# EAGLE design clock (EAGLE 9.6.2)
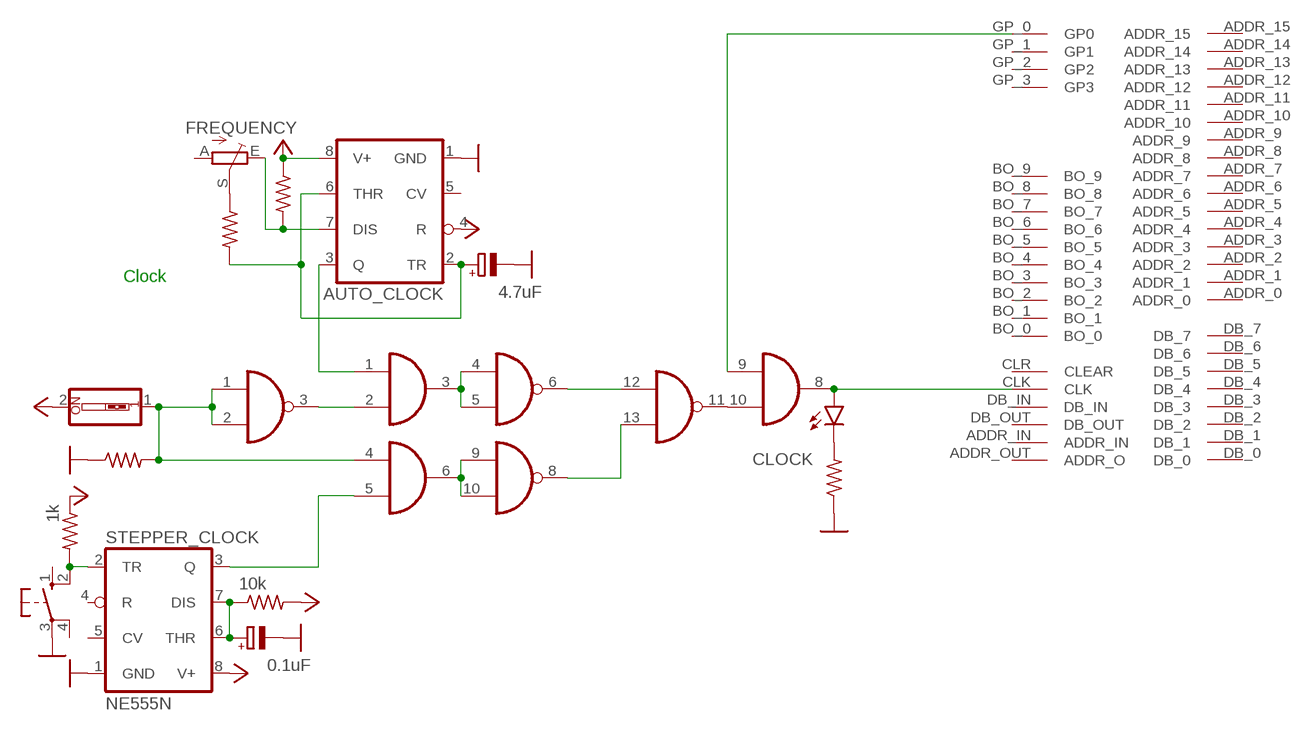
[diagram p0: schematic, sheet 1]

## Parts
AND_GATE_  74LS08N  [DIL14]
AUTO_CLOCK  NE555N  [DIL08]
C1  4.7uF  CPOL-EUE2-5  [E2-5]
C2  0.1uF  CPOL-EUE2-5  [E2-5]
CLK_MODE  SWITCH  SW_DIP-1  [EDG-01]
CLK_TRIGGER  SWITCH  10-XX  [B3F-10XX]
CLOCK  Yellow  LED5MM  [LED5MM]
FREQUENCY  100k  TRIM_EU-RJ9W  [RJ9W]
NAND  74ACT00N  [DIL14]
R1  1k  R-US_0204/7  [0204/7]
R2  1k  R-US_0204/7  [0204/7]
R3  10k  R-US_0204/7  [0204/7]
R4  220  R-US_0204/7  [0204/7]
R5  ~220  R-US_0204/7  [0204/7]
R6  220  R-US_0204/7  [0204/7]
STEPPER_CLOCK  NE555N  [DIL08]
U$1  BACKPLATE_INTERFACEEDGE_FINGER  [BACK_INTERFACE-FOOT]

## Nets
CLOCK: AND_GATE_.8(C:O) CLOCK.A U$1.CLK
GND: AUTO_CLOCK.1(GND) C1.- C2.- CLK_TRIGGER.3(P) R4.1 R5.1 STEPPER_CLOCK.1(GND)
HLT: AND_GATE_.9(C:I0) U$1.GP_0(GP0)
MODE_SIGNAL: AND_GATE_.4(B:I0) CLK_MODE.1 NAND.1(A:I0) NAND.2(A:I1) R4.2
N$1: C2.+ R3.1 STEPPER_CLOCK.6(THR) STEPPER_CLOCK.7(DIS)
N$2: CLK_TRIGGER.2(S1) R2.2 STEPPER_CLOCK.2(TR)
N$3: CLOCK.K(C) R5.2
N$4: AND_GATE_.5(B:I1) STEPPER_CLOCK.3(Q)
N$5: AND_GATE_.3(A:O) NAND.4(B:I0) NAND.5(B:I1)
N$6: AND_GATE_.1(A:I0) AUTO_CLOCK.3(Q)
N$7: AND_GATE_.6(B:O) NAND.9(C:I0) NAND.10(C:I1)
N$8: NAND.8(C:O) NAND.13(D:I1)
N$9: AND_GATE_.2(A:I1) NAND.3(A:O)
N$10: NAND.6(B:O) NAND.12(D:I0)
N$11: AND_GATE_.10(C:I1) NAND.11(D:O)
N$16: AUTO_CLOCK.2(TR) AUTO_CLOCK.6(THR) C1.+ R6.2
N$51: FREQUENCY.S R6.1
N$78: AUTO_CLOCK.7(DIS) FREQUENCY.E R1.2
VCC: AUTO_CLOCK.4(R) AUTO_CLOCK.8(V+) CLK_MODE.2 R1.1 R2.1 R3.2 STEPPER_CLOCK.8(V+)
Unconnected: AND_GATE_.11(D:O) AND_GATE_.12(D:I0) AND_GATE_.13(D:I1) AUTO_CLOCK.5(CV) CLK_TRIGGER.1(S) CLK_TRIGGER.4(P1) FREQUENCY.A STEPPER_CLOCK.4(R) STEPPER_CLOCK.5(CV) U$1.ADDR_0 U$1.ADDR_1 U$1.ADDR_2 U$1.ADDR_3 U$1.ADDR_4 U$1.ADDR_5 U$1.ADDR_6 U$1.ADDR_7 U$1.ADDR_8 U$1.ADDR_9 U$1.ADDR_10 U$1.ADDR_11 U$1.ADDR_12 U$1.ADDR_13 U$1.ADDR_14 U$1.ADDR_15 U$1.ADDR_IN U$1.ADDR_OUT(ADDR_O) U$1.BO_0 U$1.BO_1 U$1.BO_2 U$1.BO_3 U$1.BO_4 U$1.BO_5 U$1.BO_6 U$1.BO_7 U$1.BO_8 U$1.BO_9 U$1.CLR(CLEAR) U$1.DB_0 U$1.DB_1 U$1.DB_2 U$1.DB_3 U$1.DB_4 U$1.DB_5 U$1.DB_6 U$1.DB_7 U$1.DB_8-(NC) U$1.DB_9-(NC) U$1.DB_10-(NC) U$1.DB_11-(NC) U$1.DB_12-(NC) U$1.DB_13-(NC) U$1.DB_14-(NC) U$1.DB_15-(NC) U$1.DB_IN U$1.DB_OUT U$1.GP_1(GP1) U$1.GP_2(GP2) U$1.GP_3(GP3) U$1.NC_0 U$1.NC_1 U$1.NC_2 U$1.NC_3 U$1.NC_4 U$1.NC_5 U$1.NC_6 U$1.NC_7

## Notes on the sheet
- Clock

## Power pins joined to a net without a drawn wire
GND: AND_GATE_.7(P:GND) NAND.7(P:GND) U$1.GND_0(GND) U$1.GND_1(GND)
VCC: AND_GATE_.14(P:VCC) NAND.14(P:VCC) U$1.VCC_0(VCC) U$1.VCC_1(VCC)

## Library data of the parts
AND_GATE_ = 74xx-eu:74*08: Quad 2-input AND gate
AUTO_CLOCK STEPPER_CLOCK = linear:*555: TIMER
C1 C2 = rcl:CPOL-EU: POLARIZED CAPACITOR, European symbol; SPICEPREFIX: C
CLK_MODE = special:SW_DIP-1: DIP SWITCH
CLK_TRIGGER = switch-omron:10-XX: OMRON SWITCH; MPN: B3F-1000; OC_FARNELL: 176432; OC_NEWARK: 36M3542
CLOCK = led:LED: LED OSRAM: - CHIPLED LG R971, LG N971, LY N971, LG Q971, LY Q971, LO R971, LY R971 LH N974, LH R974 LS Q976, LO Q976, LY Q976 LO Q996 - Hyper CHIPLED LW Q18S LB Q993, LB Q99A, LB R99A - SideLED LS A670, LO A670, LY A670, LG A670, LP A670 LB A673, LV A673, LT A673, LW A673 LH A674 LY A675 LS A676, LA A676, LO A676, LY A676, LW A676 LS A679, LY A679, LG A679 - Hyper Micro SIDELED® LS Y876, LA Y876, LO Y876, LY Y876 LT Y87S - SmartLED LW L88C, LW L88S LB L89C, LB L89S, LG L890 LS L89K, LO L89K, LY L89K LS L896, LA L896, LO L896, LY L896 - TOPLED LS T670, LO T670, LY T670, LG T670, LP T670 LSG T670, LSP T670, LSY T670, LOP T670, LYG T670 LG T671, LOG T671, LSG T671 LB T673, LV T673, LT T673, LW T673 LH T674 LS T676, LA T676, LO T676, LY T676, LB T676, LH T676, LSB T676, LW T676 LB T67C, LV T67C, LT T67C, LS T67K, LO T67K, LY T67K, LW E67C LS E67B, LA E67B, LO E67B, LY E67B, LB E67C, LV E67C, LT E67C LW T67C LS T679, LY T679, LG T679 LS T770, LO T770, LY T770, LG T770, LP T770 LB T773, LV T773, LT T773, LW T773 LH T774 LS E675, LA E675, LY E675, LS T675 LS T776, LA T776, LO T776, LY T776, LB T776 LHGB T686 LT T68C, LB T68C - Hyper Mini TOPLED® LB M676 - Mini TOPLED Santana® LG M470 LS M47K, LO M47K, LY M47K Source: http://www.osram.convergy.de LUXEON: - LUMILED® LXK2-PW12-R00, LXK2-PW12-S00, LXK2-PW14-U00, LXK2-PW14-V00 LXK2-PM12-R00, LXK2-PM12-S00, LXK2-PM14-U00 LXK2-PE12-Q00, LXK2-PE12-R00, LXK2-PE12-S00, LXK2-PE14-T00, LXK2-PE14-U00 LXK2-PB12-K00, LXK2-PB12-L00, LXK2-PB12-M00, LXK2-PB14-N00, LXK2-PB14-P00, LXK2-PB14-Q00 LXK2-PR12-L00, LXK2-PR12-M00, LXK2-PR14-Q00, LXK2-PR14-R00 LXK2-PD12-Q00, LXK2-PD12-R00, LXK2-PD12-S00 LXK2-PH12-R00, LXK2-PH12-S00 LXK2-PL12-P00, LXK2-PL12-Q00, LXK2-PL12-R00 Source: www.luxeon.com KINGBRIGHT: KA-3528ASYC Source: www.kingbright.com
FREQUENCY = pot:TRIM_EU-: POTENTIOMETER
NAND = 74xx-eu:74*00: Quad 2-input NAND gate
R1-R6 = rcl:R-US_: RESISTOR, American symbol; SPICEPREFIX: R
U$1 = Computer:BACKPLATE_INTERFACE

## Board
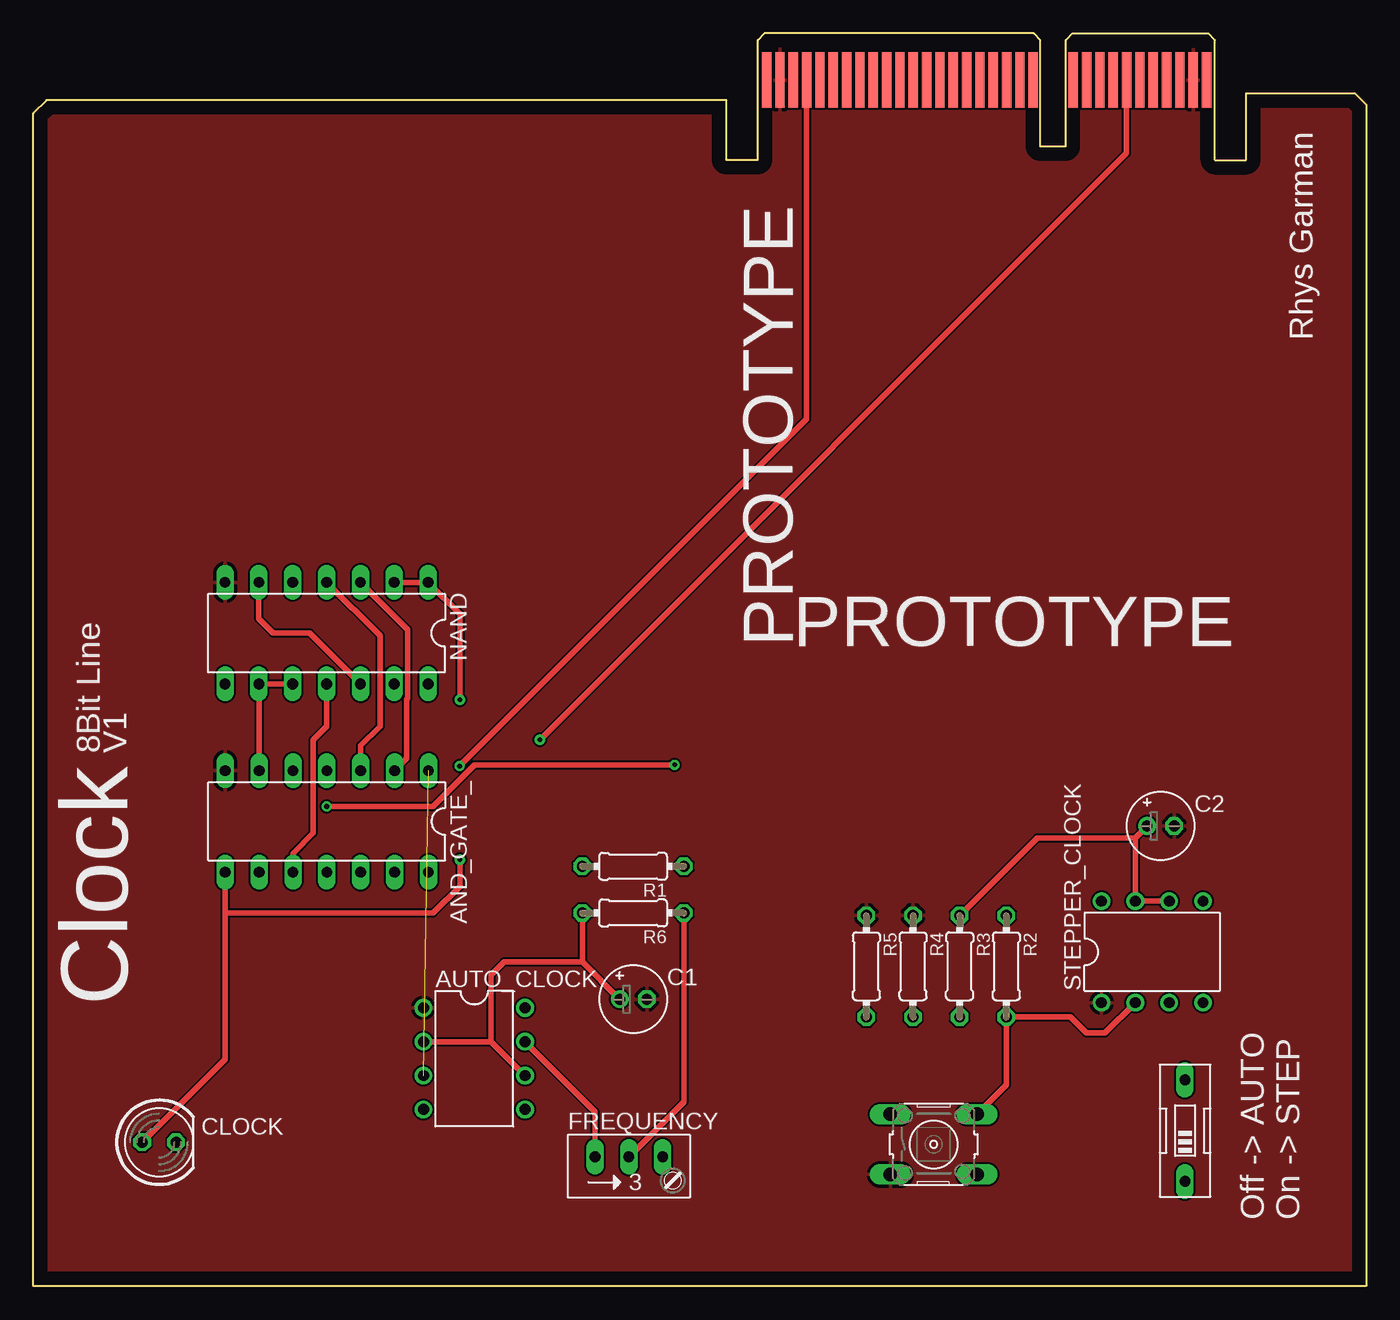
[diagram p1: board, top side]
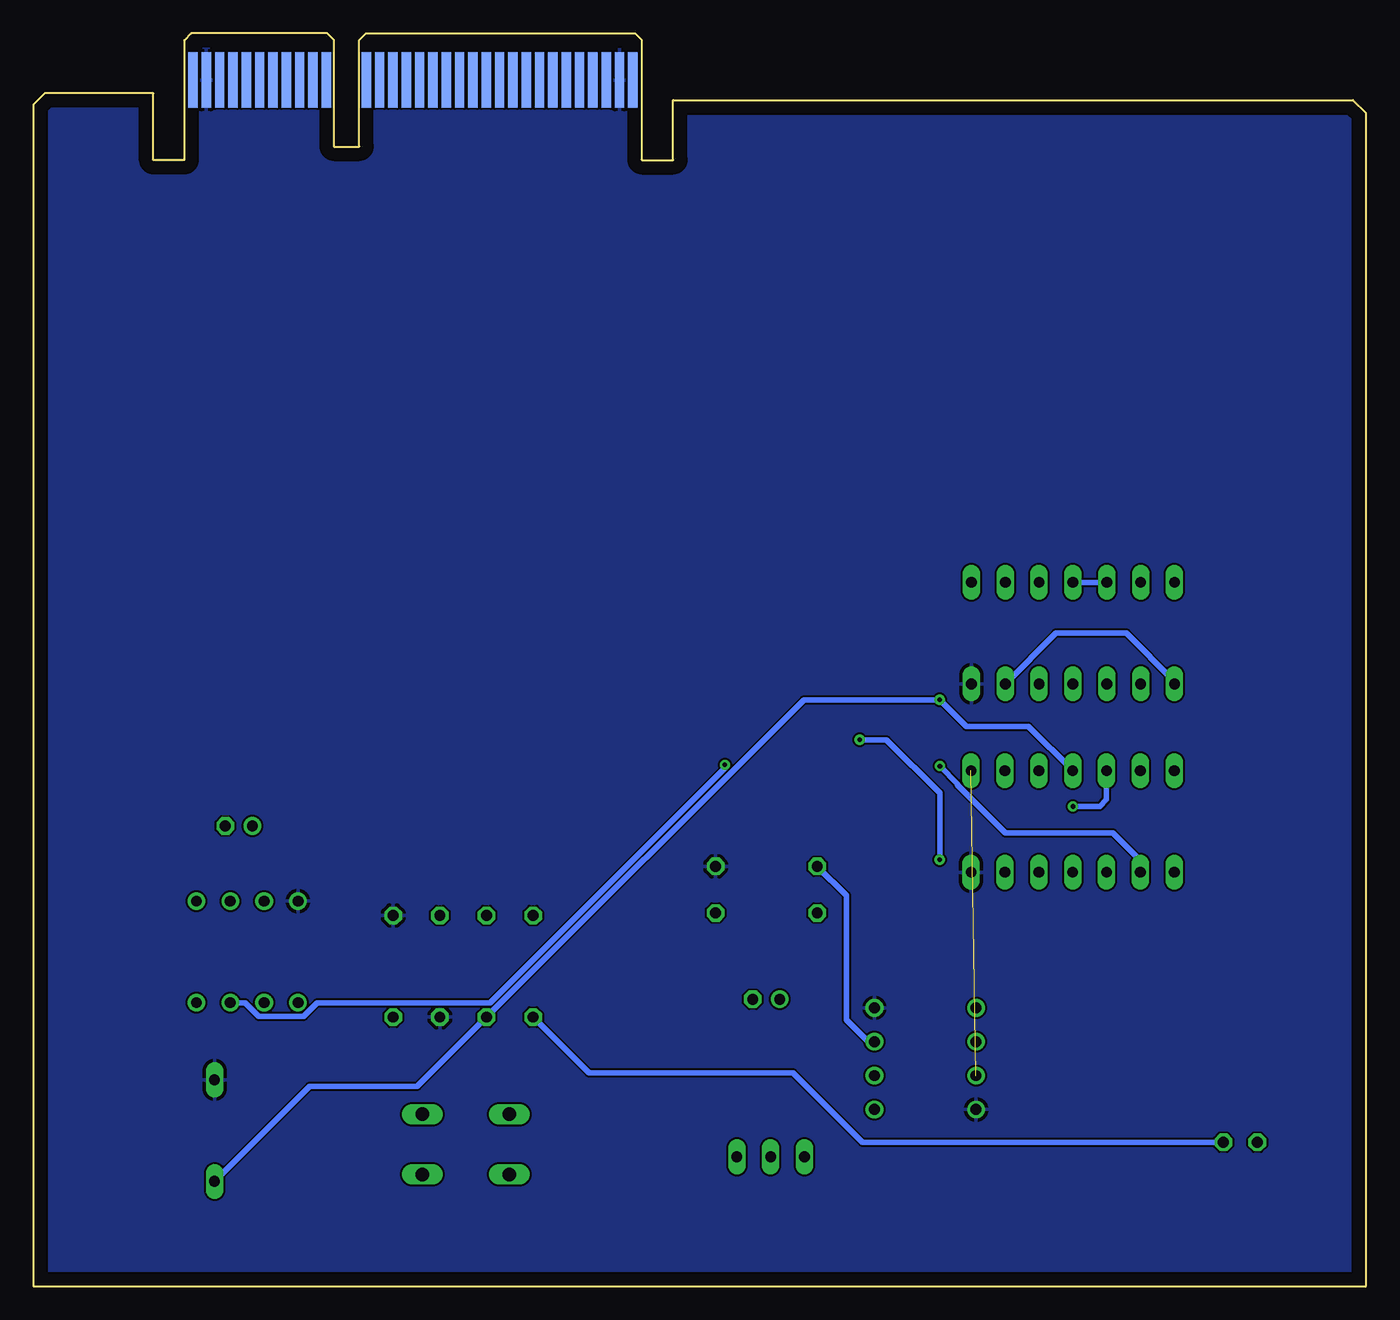
[diagram p2: board, bottom side, seen from below]

Size 100 x 94 mm. Coordinates in mm from the lower left corner, seen from the top.
Outline: 0,0 0,88 1,89 52,89 52,84.5 54.35,84.5 54.35,93.5 54.85,94 75.05,94 75.55,93.5 75.55,85.5 77.45,85.5 77.45,93.5 77.95,94 88.15,94 88.65,93.5 88.65,84.5 91,84.5 91,89.5 99.15,89.5 100,88.65 100,0 0,0
Copper layers (1*16): Top 0.035mm / dielectric 1.5mm / Bottom 0.035mm
Design rules "default": minimum track width 6mil, minimum drill 0.35mm, track to track 6mil, track to pad 6mil, pad to pad 6mil, via to via 6mil, smd to smd 6mil, copper to edge 40mil, drill to drill 6mil, minimum pad ring 10mil, minimum via ring 8mil, stop-mask expansion 4mil, vias tented up to drill 0mil, thermal gap 10mil

### Footprints (pad centres in the part's own frame; a part is rotated, then mirrored left to right if it is on the bottom)
DIL14 = drill 0.813 long: 1 -7.62,-3.81; 2 -5.08,-3.81; 3 -2.54,-3.81; 4 0,-3.81; 5 2.54,-3.81; 6 5.08,-3.81; 7 7.62,-3.81; 8 7.62,3.81; 9 5.08,3.81; 10 2.54,3.81; 11 0,3.81; 12 -2.54,3.81; 13 -5.08,3.81; 14 -7.62,3.81
DIL08 = drill 0.813 pad 1.27: 1 -3.81,-3.81; 2 -1.27,-3.81; 3 1.27,-3.81; 4 3.81,-3.81; 5 3.81,3.81; 6 1.27,3.81; 7 -1.27,3.81; 8 -3.81,3.81
E2-5 = drill 0.813 pad 1.27: + -1.016,0 | drill 0.813 pad 1.27 octagon: - 1.016,0
EDG-01 = drill 0.813 long: 1 0,-3.81; 2 0,3.81
B3F-10XX = drill 1.016 long: 1 -3.251,2.261; 2 3.251,2.261; 3 -3.251,-2.261; 4 3.251,-2.261
LED5MM = drill 0.813 octagon: A -1.27,0; K 1.27,0
RJ9W = drill 0.813 long: A 2.54,0.635; E -2.54,0.635; S 0,0.635
0204/7 = drill 0.813 octagon: 1 -3.81,0; 2 3.81,0
BACK_INTERFACE-FOOT = smd 0.7 x 4.2: ADDR_0 19.02,0; ADDR_1 18.02,0; ADDR_2 17.02,0; ADDR_3 16.02,0; ADDR_4 15.02,0; ADDR_5 14.02,0; ADDR_6 13.02,0; ADDR_7 12.02,0; ADDR_8 11.02,0; ADDR_9 10.02,0; ADDR_10 9.02,0; ADDR_11 8.02,0; ADDR_12 7.02,0; ADDR_13 6.02,0; ADDR_14 5.02,0; ADDR_15 4.02,0; ADDR_IN 24.02,0; ADDR_OUT 25.02,0; BO_8 29.02,0; BO_9 26.02,0; CLK 27.02,0; CLR 28.02,0; DB_IN 31.02,0; DB_OUT 30.02,0; GND_0 32.02,0; GND_1 1.02,0; GP_0 3.02,0; GP_1 2.02,0; NC_0 33.02,0; NC_1 23.02,0; NC_2 20.02,0; NC_3 0.02,0 | smd 0.7 x 4.2 bottom: BO_0 31.02,0; BO_1 30.02,0; BO_2 29.02,0; BO_3 28.02,0; BO_4 27.02,0; BO_5 26.02,0; BO_6 25.02,0; BO_7 24.02,0; DB_0 19.02,0; DB_1 18.02,0; DB_2 17.02,0; DB_3 16.02,0; DB_4 15.02,0; DB_5 14.02,0; DB_6 13.02,0; DB_7 12.02,0; DB_8-(NC) 11.02,0; DB_9-(NC) 10.02,0; DB_10-(NC) 9.02,0; DB_11-(NC) 8.02,0; DB_12-(NC) 7.02,0; DB_13-(NC) 6.02,0; DB_14-(NC) 5.02,0; DB_15-(NC) 4.02,0; GP_2 3.02,0; GP_3 2.02,0; NC_4 33.02,0; NC_5 23.02,0; NC_6 20.02,0; NC_7 0.02,0; VCC_0 32.02,0; VCC_1 1.02,0

### Placement (x,y rotation side)
AND_GATE_  22.02,34.87 180 top
AUTO_CLOCK  33.08,17.07 270 top
C1  45.01,21.53 0 top
C2  84.58,34.53 0 top
CLK_MODE  86.41,11.67 0 top
CLK_TRIGGER  67.55,10.64 0 top
CLOCK  9.44,10.8 0 top
FREQUENCY  44.68,9.07 0 top
NAND  22,49 180 top
R1  45,31.5 180 top
R2  73,24 270 top
R3  69.5,24 270 top
R4  66,24 270 top
R5  62.5,24 270 top
R6  45,28 180 top
STEPPER_CLOCK  83.95,25.08 0 top
U$1  55,90.5 0 top

### Tracks (layer width: path | path; a pad name or v marks a point on that pad's centre or on a via)
CLOCK  (via drill 0.35)
  Top 0.406: CLOCK.A 14.4,17.03 14.4,28 | 14.4,28 AND_GATE_.8 | v32,32 32,30 30,28 14.4,28 | v38,41 82.02,85.02 U$1.CLK
  Bottom 0.406: v32,32 32,37 36,41 v38,41
GND
  pour Top: 0,88 1,89 52,89 52,84.5 54.35,84.5 54.35,93.5 54.85,94 75.05,94 75.55,93.5 75.55,85.5 77.45,85.5 77.45,93.5 77.95,94 88.15,94 88.65,93.5 88.65,84.5 91,84.5 91,89.5 99.15,89.5 100,88.65 100,0 0,0
HLT  (via drill 0.35)
  Top 0.406: U$1.GP_0 58.02,65.06 v31.98,39.02
  Bottom 0.406: v31.98,39.02 30.66,37.69 30.66,37.6 27.06,34 19,34 16.94,31.94 AND_GATE_.9
MODE_SIGNAL  (via drill 0.35)
  Top 0.406: NAND.2 NAND.1 32,50.43 v32,44
  Bottom 0.406: AND_GATE_.4 25.34,42 30,42 v32,44 42.19,44 R4.2 71.19,15 79.27,15 CLK_MODE.1
N$1
  Top 0.406: C2.+ 82.68,33.65 | 82.68,33.65 STEPPER_CLOCK.7 STEPPER_CLOCK.6 | R3.1 75.34,33.65 82.68,33.65
N$2
  Top 0.406: CLK_TRIGGER.2 73,15.1 R2.2 77.81,20.19 79,19 80.41,19 STEPPER_CLOCK.2
N$3
  Bottom 0.406: CLOCK.K 37.8,10.8 43,16 58.31,16 R5.2
N$4  (via drill 0.35)
  Top 0.406: v48.11,39.11 33.11,39.11 30,36 v22,36
  Bottom 0.406: STEPPER_CLOCK.3 84.12,21.27 83.1,20.25 79.72,20.25 78.7,21.27 65.73,21.27 48.11,38.89 v48.11,39.11 | v22,36 20,36 19.48,36.52 AND_GATE_.5
N$5
  Top 0.406: NAND.4 26,48.81 26,42 24.56,40.56 AND_GATE_.3
  Bottom 0.406: NAND.5 NAND.4
N$6  (1 unrouted)
N$7
  Top 0.406: AND_GATE_.6 16.94,45.17 | 16.94,45.17 NAND.9 | NAND.10 19.44,45.17 16.94,45.17
N$8
  Bottom 0.406: NAND.8 14.38,45.38 18,49 23.27,49 NAND.13
N$9
  Top 0.406: NAND.3 28.1,49.25 28.1,44.11 28,44.01 28,39.58 AND_GATE_.2
N$10
  Top 0.406: NAND.12 20.73,49 18,49 16.92,50.08 NAND.6
N$11
  Top 0.406: NAND.11 22,42 21,41 21,34 19.48,32.48 AND_GATE_.10
N$16
  Top 0.406: C1.+ 41.19,24.33 | 41.19,24.33 R6.2 | AUTO_CLOCK.6 34.35,18.34 | 34.35,18.34 AUTO_CLOCK.2 | 34.35,18.34 34.35,23.35 35.33,24.33 41.19,24.33
N$51
  Top 0.406: FREQUENCY.S 48.81,13.84 R6.1
N$78
  Top 0.406: FREQUENCY.E 42.14,13.09 AUTO_CLOCK.7
  Bottom 0.406: R1.2 39,29.31 39,20 37.34,18.34 AUTO_CLOCK.7
VCC
  pour Bottom: 0,88 1,89 52,89 52,84.5 54.35,84.5 54.35,93.5 54.85,94 75.05,94 75.55,93.5 75.55,85.5 77.45,85.5 77.45,93.5 77.95,94 88.15,94 88.65,93.5 88.65,84.5 91,84.5 91,89.5 99.15,89.5 100,88.65 100,0 0,0

### Text on the board
tNames: Rhys Garman | PROTOTYPE | PROTOTYPE | 8Bit Line | V1 | Clock | Off -> AUTO / On -> STEP